# Altium schematic sheet AIRLIFT_SCH.SchDoc
size A; SheetNumber: 3; SheetTotal: 3
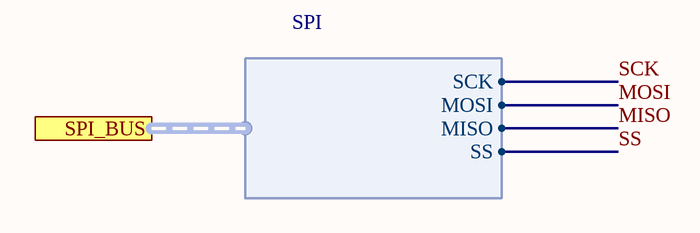
[diagram p0: AIRLIFT_SCH.SchDoc]

## Ports
SPI_BUS (harness SPI)

## Harnesses
SPI: SCK, MOSI, MISO, SS

## Nets
MISO: port SPI_BUS.MISO
MOSI: port SPI_BUS.MOSI
SCK: port SPI_BUS.SCK
SS: port SPI_BUS.SS